# EAGLE schematic pic1 (EAGLE 6.5.0)
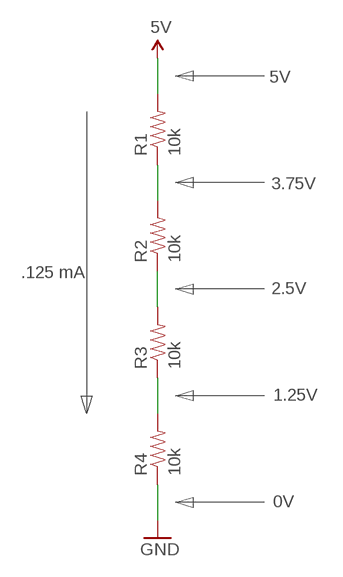
[diagram p0: schematic, sheet 1]

## Parts
R1  10k  330OHM1/10W1%(0603)  [0603-RES]
R2  10k  330OHM1/10W1%(0603)  [0603-RES]
R3  10k  330OHM1/10W1%(0603)  [0603-RES]
R4  10k  330OHM1/10W1%(0603)  [0603-RES]

## Nets
5V: R1.2
GND: R4.1
N$4: R2.1 R3.2
N$15: R1.1 R2.2
N$16: R3.1 R4.2

## Notes on the sheet
- 5V
- 3.75V
- .125 mA
- 2.5V
- 1.25V
- 0V

## Library data of the parts
R1-R4 = SparkFun-Resistors:330OHM1/10W1%(0603): RES-00818; PROD_ID: RES-00818; VALUE: 330